# EAGLE schematic controller_board (EAGLE 9.4.0)
Assembly variants: Minimal, FullAwesome
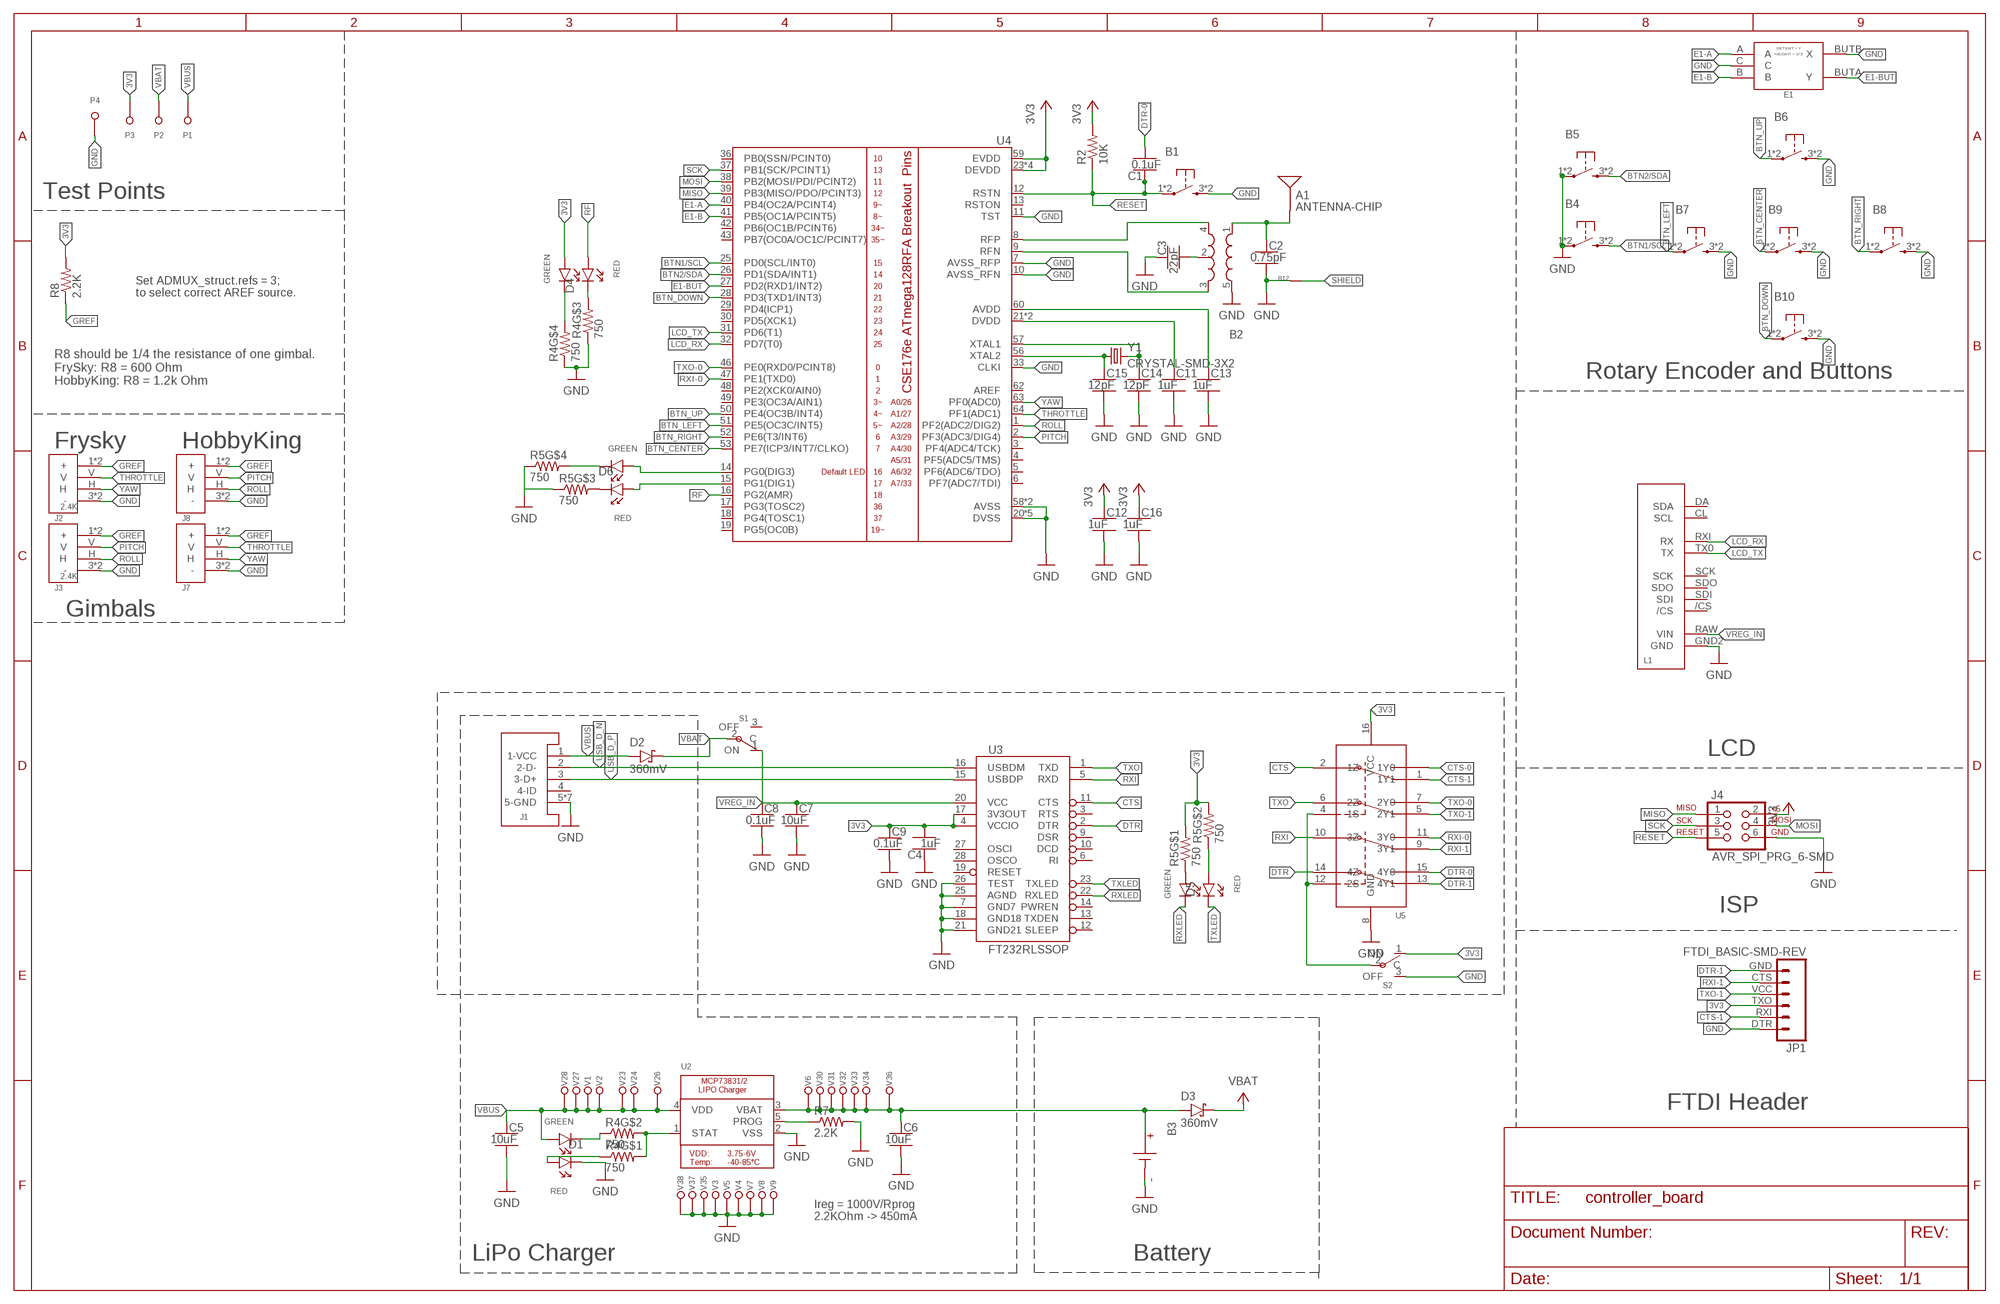
[diagram p0: schematic, sheet 1]
FRAME1 (FRAME_B_L): CREATOR: Unknown; DIST: Unknown; DISTPN: Unknown

## Parts
A1  ANTENNA-CHIP  [ANTENNA-CHIP]
B1  PUSHBUTTON_-4.5X4.5  [4.5MM_TACTILE_SWITCH_TL3305AF160QG]
B2  BALUN0805  [BALUN]
B3  BATTERY  [BATTERY-TERMINALS]
B4  PUSHBUTTON_-4.5X4.5  [4.5MM_TACTILE_SWITCH_TL3305AF160QG]  (not fitted in variant Minimal)
B5  PUSHBUTTON_-4.5X4.5  [4.5MM_TACTILE_SWITCH_TL3305AF160QG]  (not fitted in variant Minimal)
B6  PUSHBUTTON_-4.5X4.5  [4.5MM_TACTILE_SWITCH_TL3305AF160QG]
B7  PUSHBUTTON_-4.5X4.5  [4.5MM_TACTILE_SWITCH_TL3305AF160QG]
B8  PUSHBUTTON_-4.5X4.5  [4.5MM_TACTILE_SWITCH_TL3305AF160QG]
B9  PUSHBUTTON_-4.5X4.5  [4.5MM_TACTILE_SWITCH_TL3305AF160QG]
B10  PUSHBUTTON_-4.5X4.5  [4.5MM_TACTILE_SWITCH_TL3305AF160QG]
B12  NET_BRIDGE  [NET_BRIDGE]
C1  0.1uF  CAPACITOR-NP_SMD-0603_CERAMIC-0.1UF  [CAPC1608X100]
C2  0.75pF  CAPACITOR-NP_SMD-0603_CERAMIC-0.75PF  [CAPC1608X100]
C3  22pF  CAPACITOR-NP_SMD-0603_CERAMIC-22PF  [CAPC1608X100]
C4  1uF  CAPACITOR-NP_SMD-0603_CERAMIC-1UF  [CAPC1608X100]
C5  10uF  CAPACITOR-NP_SMD-0603_CERAMIC-10UF  [CAPC1608X100]
C6  10uF  CAPACITOR-NP_SMD-0603_CERAMIC-10UF  [CAPC1608X100]
C7  10uF  CAPACITOR-NP_SMD-0603_CERAMIC-10UF  [CAPC1608X100]  (not fitted in variant Minimal)
C8  0.1uF  CAPACITOR-NP_SMD-0603_CERAMIC-0.1UF  [CAPC1608X100]  (not fitted in variant Minimal)
C9  0.1uF  CAPACITOR-NP_SMD-0603_CERAMIC-0.1UF  [CAPC1608X100]  (not fitted in variant Minimal)
C11  1uF  CAPACITOR-NP_SMD-0603_CERAMIC-1UF  [CAPC1608X100]
C12  1uF  CAPACITOR-NP_SMD-0603_CERAMIC-1UF  [CAPC1608X100]
C13  1uF  CAPACITOR-NP_SMD-0603_CERAMIC-1UF  [CAPC1608X100]
C14  12pF  CAPACITOR-NP_SMD-0603_CERAMIC-12PF  [CAPC1608X100]
C15  12pF  CAPACITOR-NP_SMD-0603_CERAMIC-12PF  [CAPC1608X100]
C16  1uF  CAPACITOR-NP_SMD-0603_CERAMIC-1UF  [CAPC1608X100]
D1  LED-2X-GREEN/RED-1.6X1.5MM  [LED-2X-LITE-ON-1.6MMX1.5MM]
D2  360mV  DIODE-SCHOTTKY_SMD-SOD123-360MV  [SOD3716X135_HS]
D3  360mV  DIODE-SCHOTTKY_SMD-SOD123-360MV  [SOD3716X135_HS]
D4  LED-2X-GREEN/RED-1.6X1.5MM  [LED-2X-LITE-ON-1.6MMX1.5MM]
D5  LED-2X-GREEN/RED-1.6X1.5MM  [LED-2X-LITE-ON-1.6MMX1.5MM]  (not fitted in variant Minimal)
D6  LED-2X-GREEN/RED-1.6X1.5MM  [LED-2X-LITE-ON-1.6MMX1.5MM]
E1  ROTARY-ENCODER-W/BUTTON-BOURNS-PEC12R-4217F  [BOURNS-PEC12R]
J1  USB-MICROA-AMPHENOL-10118192-0001LF  [USB-MICROA-10118192-0001LF]  (not fitted in variant Minimal)
J2  2.4K  FRSKY-GIMBAL-FRYSKY  [JST-13-PTH]  (not fitted in variant Minimal)
J3  2.4K  FRSKY-GIMBAL-FRYSKY  [JST-13-PTH]  (not fitted in variant Minimal)
J4  AVR_SPI_PRG_6-SMD  [2X3-SMD]
J7  FRSKY-GIMBAL-2X-SERVO-SMD  [2X-SERVO-SMD]
J8  FRSKY-GIMBAL-2X-SERVO-SMD  [2X-SERVO-SMD]
JP1  FTDI_BASIC-SMD-REV  [FTDI-BASIC-SMD]
L1  SPARKFUN_SERLCD_SERIAL_REDUCED-SMD  [SPARKFUN_SERLCD_16X2_REDUCED_SMD]
P1  TEST-POINT  [TEST-POINT-KEYSTONE-5000]  (not fitted in variant Minimal)
P2  TEST-POINT  [TEST-POINT-KEYSTONE-5000]  (not fitted in variant Minimal)
P3  TEST-POINT  [TEST-POINT-KEYSTONE-5000]  (not fitted in variant Minimal)
P4  TEST-POINT  [TEST-POINT-KEYSTONE-5000]  (not fitted in variant Minimal)
R2  10K  RESISTOR_SMD-0603-10K  [RESC1608X55]
R4  750  RESISTOR-PACK-4X-750  [RESCAXS50P200X100X45-8]
R5  750  RESISTOR-PACK-4X-750  [RESCAXS50P200X100X45-8]
R7  2.2K  RESISTOR_SMD-0603-2.2K  [RESC1608X55]
R8  2.2K  RESISTOR_SMD-0603-2.2K  [RESC1608X55]  (not fitted in variant Minimal)
S1  POWER-SWITCH-MFS201N-9-Z-SMD-VERTICAL  [JS102011JCQN]  (not fitted in variant Minimal)
S2  POWER-SWITCH-MFS201N-9-Z-SMD-VERTICAL  [JS102011JCQN]  (not fitted in variant Minimal)
U2  MCP73831T-2ACI/OT  MCP73831/2  [SOT23-5]
U3  FT232RLSSOP  [SSOP28DB]  (not fitted in variant Minimal)
U4  ATMEGA128RFA1  [QFN-64]
U5  DPDT-X2  [SOP65P640X110-16]  (not fitted in variant Minimal)
V1  LOCKED-VIA-0.2  [VIA-0.2MM]
V2  LOCKED-VIA-0.2  [VIA-0.2MM]
V3  LOCKED-VIA-0.2  [VIA-0.2MM]
V4  LOCKED-VIA-0.2  [VIA-0.2MM]
V5  LOCKED-VIA-0.2  [VIA-0.2MM]
V6  LOCKED-VIA-0.2  [VIA-0.2MM]
V7  LOCKED-VIA-0.2  [VIA-0.2MM]
V8  LOCKED-VIA-0.2  [VIA-0.2MM]
V9  LOCKED-VIA-0.2  [VIA-0.2MM]
V23  LOCKED-VIA-0.2  [VIA-0.2MM]
V24  LOCKED-VIA-0.2  [VIA-0.2MM]
V26  LOCKED-VIA-0.2  [VIA-0.2MM]
V27  LOCKED-VIA-0.2  [VIA-0.2MM]
V28  LOCKED-VIA-0.2  [VIA-0.2MM]
V30  LOCKED-VIA-0.2  [VIA-0.2MM]
V31  LOCKED-VIA-0.2  [VIA-0.2MM]
V32  LOCKED-VIA-0.2  [VIA-0.2MM]
V33  LOCKED-VIA-0.2  [VIA-0.2MM]
V34  LOCKED-VIA-0.2  [VIA-0.2MM]
V35  LOCKED-VIA-0.2  [VIA-0.2MM]
V36  LOCKED-VIA-0.2  [VIA-0.2MM]
V37  LOCKED-VIA-0.2  [VIA-0.2MM]
V38  LOCKED-VIA-0.2  [VIA-0.2MM]
Y1  CRYSTAL-SMD-3X2  [OSCCC320X250X85]

## Nets
3V3 [HIGH-I]: C4.2 C9.1 C12.1 C16.1 D4.A2 J4.2 JP1.TXO P3.T R2.2 R5.5 R5.6 R8.2 S2.1(ON) U3.4(VCCIO) U3.17(3V3OUT) U4.23(DEVDD) U4.34(DEVDD) U4.44(DEVDD) U4.54(DEVDD) U4.59(EVDD) U5.16(VCC)
ANTENNA [RFSIG]: A1.FEED(SIGNAL) B2.1(IN) C2.1
BCAP: B2.2(GND) C3.2
BPOS [LONG_PWR]: B3.+(P) C6.1 D3.A U2.3(VBAT) V6.P1(N) V30.P1(N) V31.P1(N) V32.P1(N) V33.P1(N) V34.P1(N) V36.P1(N)
BTN1/SCL: B4.3 B4.4 U4.25(PD0(SCL/INT0))
BTN2/SDA: B5.3 B5.4 U4.26(PD1(SDA/INT1))
BTN_CENTER: B9.1 B9.2 U4.53(PE7(ICP3/INT7/CLKO))
BTN_DOWN: B10.1 B10.2 U4.28(PD3(TXD1/INT3))
BTN_LEFT: B7.1 B7.2 U4.51(PE5(OC3C/INT5))
BTN_RIGHT: B8.1 B8.2 U4.52(PE6(T3/INT6))
BTN_UP: B6.1 B6.2 U4.50(PE4(OC3B/INT4))
CLK_NEG: C15.1 U4.56(XTAL2) Y1.1
CLK_POS: C14.1 U4.57(XTAL1) Y1.3
CTS: U3.11(CTS) U5.2(1Z)
CTS-0: U5.3(1Y0)
CTS-1: JP1.RXI U5.1(1Y1)
DTR: U3.2(DTR) U5.14(4Z)
DTR-0: C1.2 U5.15(4Y0)
DTR-1: JP1.GND U5.13(4Y1)
E1-A: E1.A U4.40(PB4(OC2A/PCINT4))
E1-B: E1.B U4.41(PB5(OC1A/PCINT5))
E1-BUT: E1.BUTA(Y) U4.27(PD2(RXD1/INT2))
GND [HIGH-I]: B1.3 B1.4 B2.5(GND) B3.-(N) B4.1 B4.2 B5.1 B5.2 B6.3 B6.4 B7.3 B7.4 B8.3 B8.4 B9.3 B9.4 B10.3 B10.4 B12.P1 C2.2 C3.1 C4.1 C5.2 C6.2 C7.2 C8.2 C9.2 C11.2 C12.2 C13.2 C14.2 C15.2 C16.2 D1.C1 E1.BUTB(X) E1.C J1.5(5-GND) J1.6(5-GND) J1.7(5-GND) J1.8(5-GND) J1.9(5-GND) J1.10(5-GND) J1.11(5-GND) J2.3(-) J2.6(-) J3.3(-) J3.6(-) J4.6 J7.3(-) J7.6(-) J8.3(-) J8.6(-) JP1.DTR L1.GND2(GND) P4.T R4.1 R4.2 R5.1 R5.2 R7.2 S2.3(OFF) U2.2(VSS) U3.7(GND7) U3.18(GND18) U3.21(GND21) U3.25(AGND) U3.26(TEST) U4.7(AVSS_RFP) U4.10(AVSS_RFN) U4.11(TST) U4.20(DVSS) U4.24(DVSS) U4.33(CLKI) U4.35(DVSS) U4.45(DVSS) U4.55(DVSS) U4.58(AVSS) U4.61(AVSS) U5.8(GND) V3.P1(N) V4.P1(N) V5.P1(N) V7.P1(N) V8.P1(N) V9.P1(N) V35.P1(N) V37.P1(N) V38.P1(N)
GREF: J2.1(+) J2.4(+) J3.1(+) J3.4(+) J7.1(+) J7.4(+) J8.1(+) J8.4(+) R8.1
LCD_RX: L1.RXI(RX) U4.32(PD7(T0))
LCD_TX: L1.TX0(TX) U4.31(PD6(T1))
MISO: J4.1 U4.39(PB3(MISO/PDO/PCINT3))
MOSI: J4.4 U4.38(PB2(MOSI/PDI/PCINT2))
N$1: D1.A1 R4.4
N$2: D1.C2 R4.3
N$3: D5.A1 R5.3
N$4: D6.C2 R5.8
N$5: D6.C1 R5.7
N$6: D4.C1 R4.7
N$7: D5.A2 R5.4
N$8: D6.A2 U4.14(PG0(DIG3))
N$9: D6.A1 U4.15(PG1(DIG1))
N$11: R4.5 R4.6 U2.1(STAT)
N$12: R7.1 U2.5(PROG)
N$13: D4.C2 R4.8
N$20: C11.1 U4.21(DVDD) U4.22(DVDD)
N$21: C13.1 U4.60(AVDD)
PITCH: J3.V J8.V U4.2(PF3(ADC3/DIG4))
PROG_SEL: S2.2(C) U5.4(1S) U5.12(2S)
RESET: B1.1 B1.2 C1.1 J4.5 R2.1 U4.12(RSTN)
RF: D4.A1 U4.16(PG2(AMR))
RF_N: B2.3(OUT2) U4.9(RFN)
RF_P: B2.4(OUT1) U4.8(RFP)
ROLL: J3.H J8.H U4.1(PF2(ADC2/DIG2))
RXI: U3.5(RXD) U5.10(3Z)
RXI-0: U4.47(PE1(TXD0)) U5.11(3Y0)
RXI-1: JP1.CTS U5.9(3Y1)
RXLED: D5.C2 U3.22(RXLED)
SCK: J4.3 U4.37(PB1(SCK/PCINT1))
SHIELD: B12.P2
THROTTLE: J2.V J7.V U4.64(PF1(ADC1))
TXLED: D5.C1 U3.23(TXLED)
TXO: U3.1(TXD) U5.6(2Z)
TXO-0: U4.46(PE0(RXD0/PCINT8)) U5.7(2Y0)
TXO-1: JP1.VCC U5.5(2Y1)
USB_D_N: J1.2(2-D-) U3.16(USBDM)
USB_D_P: J1.3(3-D+) U3.15(USBDP)
VBAT [PWR]: D2.C D3.C P2.T S1.2(C)
VBUS [PWR]: C5.1 D1.A2 D2.A J1.1(1-VCC) P1.T U2.4(VDD) V1.P1(N) V2.P1(N) V23.P1(N) V24.P1(N) V26.P1(N) V27.P1(N) V28.P1(N)
VREG_IN [PWR]: C7.1 C8.1 L1.RAW(VIN) S1.1(ON) U3.20(VCC)
YAW: J2.H J7.H U4.63(PF0(ADC0))
Unconnected: J1.4(4-ID) L1./CS L1.CL(SCL) L1.DA(SDA) L1.SCK L1.SDI L1.SDO S1.3(OFF) U3.3(RTS) U3.6(RI) U3.9(DSR) U3.10(DCD) U3.12(SLEEP) U3.13(TXDEN) U3.14(PWREN) U3.19(RESET) U3.27(OSCI) U3.28(OSCO) U4.3(PF4(ADC4/TCK)) U4.4(PF5(ADC5/TMS)) U4.5(PF6(ADC6/TDO)) U4.6(PF7(ADC7/TDI)) U4.13(RSTON) U4.17(PG3(TOSC2)) U4.18(PG4(TOSC1)) U4.19(PG5(OC0B)) U4.29(PD4(ICP1)) U4.30(PD5(XCK1)) U4.36(PB0(SSN/PCINT0)) U4.42(PB6(OC1B/PCINT6)) U4.43(PB7(OC0A/OC1C/PCINT7)) U4.48(PE2(XCK0/AIN0)) U4.49(PE3(OC3A/AIN1)) U4.62(AREF)

## Notes on the sheet
- Test Points
- Set ADMUX_struct.refs = 3;
  to select correct AREF source.
- Rotary Encoder and Buttons
- R8 should be 1/4 the resistance of one gimbal.
  FrySky: R8 = 600 Ohm
  HobbyKing: R8 = 1.2k Ohm
- Frysky | HobbyKing
- Gimbals
- LCD
- ISP
- FTDI Header
- Ireg = 1000V/Rprog
  2.2KOhm -> 450mA
- LiPo Charger | Battery

## Library data of the parts
A1 = quadparts_prebuilt:ANTENNA: Single endded antenna.; CREATOR: Swanson; DATASHEET: http://www.linxtechnologies.com/resources/data-guides/ant-xxx-chp-x.pdf; DIST: Digikey; DISTPN: ANT-2.45-CHPCT-ND; MFR: Linx Technologies Inc.; MOUNTING: SMD; MPN: ANT-2.45-CHP-T; PRICE: 3.16; REVIEWER: Swanson
B1 B4-B10 = quadparts_prebuilt:PUSHBUTTON_: "Tactile" or "clicky" button.; CREATOR: Swanson; DIST: DIGIKEY; DISTPN: EG5350CT-ND; MOUNTING: SMD
B2 = quadparts_prebuilt:BALUN: A balun to convert differential radio-frequency outputs from the microcontroller into a single-ended driver for the antenna.; CREATOR: Swanson; DATASHEET: http://katalog.we-online.de/pbs/datasheet/748421245.pdf; DIST: Digikey; DISTPN: 732-2230-1-ND; MFR: Wurth Electronics Inc; MOUNTING: SMD; MPN: 748421245; PRICE: 2.63; REVIEWER: Swanson
B3 = quadparts_prebuilt:BATTERY: Connections for a battery.; CREATOR: Swanson; DIST: NA; DISTPN: NA; MOUNTING: NONE
B12 = custom:NET_BRIDGE; CREATOR: Michael Gonzalez; DIST: NA; DISTPN: NA
C1 C8 C9 = quadparts_prebuilt:CAPACITOR-NP_: Nonpolarized capacitor; CREATOR: Swanson; DIST: Digikey; DISTPN: 399-1095-1-ND; MOUNTING: SMD
C2 = quadparts_prebuilt:CAPACITOR-NP_: Nonpolarized capacitor; CREATOR: Swanson; DIST: Digikey; DISTPN: 311-3843-1-ND; MOUNTING: SMD
C3 = quadparts_prebuilt:CAPACITOR-NP_: Nonpolarized capacitor; CREATOR: Swanson; DIST: Digikey; DISTPN: 478-11384-1-ND; MOUNTING: SMD
C4 C11-C13 C16 = quadparts_prebuilt:CAPACITOR-NP_: Nonpolarized capacitor; CREATOR: Swanson; DIST: Digikey; DISTPN: 1276-1182-1-ND; MOUNTING: SMD
C5-C7 = quadparts_prebuilt:CAPACITOR-NP_: Nonpolarized capacitor; CREATOR: Swanson; DIST: Digikey; DISTPN: 1276-1119-1-ND; MOUNTING: SMD
C14 C15 = quadparts_prebuilt:CAPACITOR-NP_: Nonpolarized capacitor; CREATOR: Swanson; DIST: Digikey; DISTPN: 720-1655-1-ND; MOUNTING: SMD
D1 D4-D6 = RemoteParts:LED-2X; COLOR1: GREEN; COLOR2: RED; CREATOR: Swanson; DIST: DIGIKEY; DISTPN: 160-2252-1-ND; MOUNTING: SMD
D2 D3 = quadparts_prebuilt:DIODE-SCHOTTKY_: Schottky diode; CREATOR: Swanson; DIST: Digikey; DISTPN: CRS08QMCT-ND; MFR: Toshiba Semiconductor and Storage; MOUNTING: SMD; MPN: CRS08(TE85L,Q,M); REVIEWER: Swanson
E1 = RemoteParts:ROTARY-ENCODER-W/BUTTON; AUX1DIST: DIGIKEY; AUX1DISTPN: 1722-1241-ND; CREATOR: Swanson; DETENT: Y; DIST: DIGIKEY; DISTPN: PEC12R-4217F-S0024-ND; HEIGHT: 17.5; MOUNTING: TH
J1 = RemoteParts:USB; CREATOR: Swanson; DIST: DIGIKEY; DISTPN: 609-4613-1-ND; MOUNTING: SMD
J2 = RemoteParts:FRSKY-GIMBAL; CREATOR: Swanson; DIST: Digikey; DISTPN: A100106-ND; MOUNTING: TH
J3 = RemoteParts:FRSKY-GIMBAL; CREATOR: Swanson; DIST: Digikey; DISTPN: A100106-ND; MOUNTING: TH; SPICEPREFIX: E
J4 = quadparts_prebuilt:AVR_SPI_PRG_6: AVR ISP 6 Pin This is the in-system programming (ISP) connector for Atmel Microcontrollers programming.; CREATOR: Swanson; DIST: Digikey; DISTPN: 952-1922-ND; MOUNTING: SMD
J7 J8 = RemoteParts:FRSKY-GIMBAL
JP1 = quadparts_prebuilt:FTDI_BASIC: FTDI (USB-serial converter) header bins with labels.; DIST: DIGIKEY; DISTPN: 952-3235-ND; LEFT_PIN: G; MOUNTING: SMD; RIGHT_PIN: B
L1 = RemoteParts:SPARKFUN_SERLCD_SERIAL_REDUCED; AUX1DIST: DIGIKEY; AUX1DISTPN: 952-1842-ND; AUX2DIST: Digikey; AUX2DISTPN: S5641-ND; CREATOR: Swanson; DIST: Sparkfun; DISTPN: LCD-14072
P1-P4 = RemoteParts:TEST-POINT; CREATOR: Swanson; DIST: DIGIKEY; DISTPN: 36-5001-ND; MOUNTING: TH
R2 = quadparts_prebuilt:RESISTOR_: Resistor; CREATOR: Swanson; DIST: DIGIKEY; DISTPN: 311-10KLECT-ND; MOUNTING: SMD
R4 R5 = quadparts_prebuilt:RESISTOR-PACK-4X; CREATOR: Swanson; DIST: DIGIKEY; DISTPN: Y10751CT-ND; MOUNTING: SMD
R7 R8 = quadparts_prebuilt:RESISTOR_: Resistor; CREATOR: Swanson; DIST: DIGIKEY; DISTPN: YAG3657CT-ND; MOUNTING: SMD
S1 S2 = RemoteParts:POWER-SWITCH-MFS201N-9-Z; CREATOR: Swanson; DIST: DIGIKEY; DISTPN: CKN10721CT-ND; MOUNTING: SMD
U2 = RemoteParts:MCP73831/2: MCP73831/2 LIPO Charger VDD: 3.75 - 6V Temp -40 - 85°C Programmable Charge Rate: 15-500mA NOTE: STAT is a tri-state logic output on the MCP73831 and an open-drain output on the MCP73832. SOT23-5 with 4.2V output and tri-state logic on STAT = MCP73831T-2ACI/OT; CREATOR: Adafruit; DIST: DIGIKEY; DISTPN: MCP73831T-2ACI/OTCT-ND; MOUNTING: SMD
U3 = RemoteParts:FT232RL: USB UART FT232RL 4th Generation USB UART (USB <-> Serial) Controller. Spark Fun Electronics SKU : COM-00650; CREATOR: Swanson; DIST: DIGIKEY; DISTPN: 768-1007-1-ND; MOUNTING: SMD
U4 = quadparts_prebuilt:ATMEGA128RFA1: ATmega128RFA1 8-bit AVR Microcontroller with Low Power 2.4GHz Transceiver for ZigBee and IEEE 802.15.4; CREATOR: Swanson; DATASHEET: http://www.atmel.com/Images/Atmel-8266-MCU_Wireless-ATmega128RFA1_Datasheet.pdf; DIST: Digikey; DISTPN: ATMEGA128RFA1-ZU-ND; MFR: Atmel; MOUNTING: SMD; MPN: ATMEGA128RFA1-ZUR00; PRICE: 10.21; REVIEWER: Swanson
U5 = RemoteParts:DPDT-X2; CREATOR: Swanson; DIST: DIGIKEY; DISTPN: 568-5300-1-ND; MOUNTING: SMD
V1-V9 V23 V24 V26-V28 V30-V38 = quadparts_prebuilt:LOCKED-VIA: A via that be removed via ripup.; CREATOR: Swanson; DIST: NA; DISTPN: NA; MOUNTING: NONE
Y1 = quadparts_prebuilt:CRYSTAL: Crystals to provide clock references for microcontrollers, etc.; CREATOR: Swanson; DIST: DIGIKEY; DISTPN: 535-9134-1-ND; MOUNTING: SMD

## Net classes
1 HIGH-I: drill 0.254 mm
2 RFSIG: width 1.016 mm
3 PWR: width 0.254 mm, drill 0.381 mm
4 LONG_PWR: width 0.254 mm, drill 0.381 mm